# EAGLE design PlusCart (EAGLE 7.7.0)
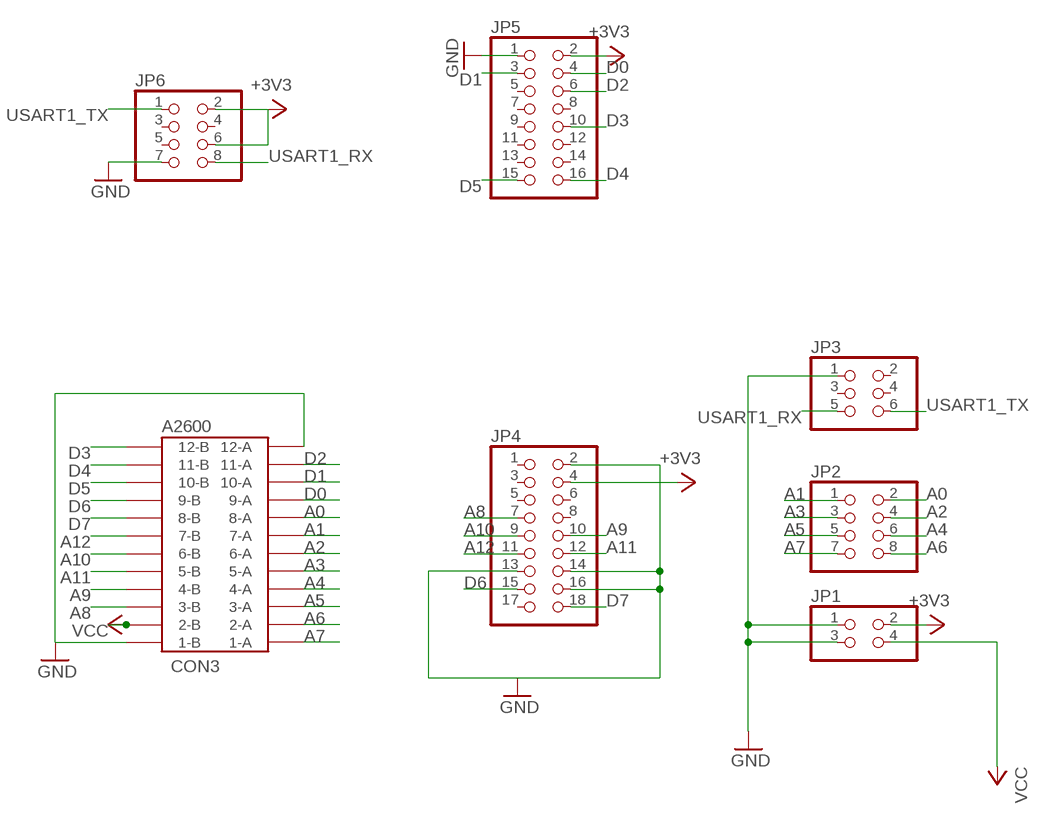
[diagram p0: schematic, sheet 1]

## Parts
CON3  A2600  24PINEDGE-254MM  [24PINEDGE-254MM]
JP1  PINHD-2X2  [2X02]
JP2  PINHD-2X4  [2X04]
JP3  PINHD-2X3  [2X03]
JP4  PINHD-2X9  [2X09]
JP5  PINHD-2X8  [2X08]
JP6  PINHD-2X4  [2X04]

## Nets
+3V3: JP1.2 JP4.4 JP5.2 JP6.2 JP6.6
A0: CON3.8-A JP2.2
A1: CON3.7-A JP2.1
A2: CON3.6-A JP2.4
A3: CON3.5-A JP2.3
A4: CON3.4-A JP2.6
A5: CON3.3-A JP2.5
A6: CON3.2-A JP2.8
A7: CON3.1-A JP2.7
A8: CON3.3-B JP4.7
A9: CON3.4-B JP4.10
A10: CON3.6-B JP4.9
A11: CON3.5-B JP4.12
A12: CON3.7-B JP4.11
D0: CON3.9-A JP5.4
D1: CON3.10-A JP5.3
D2: CON3.11-A JP5.6
D3: CON3.12-B JP5.10
D4: CON3.11-B JP5.16
D5: CON3.10-B JP5.15
D6: CON3.9-B JP4.15
D7: CON3.8-B JP4.18
GND: CON3.1-B CON3.12-A JP1.1 JP1.3 JP3.1 JP4.2 JP4.13 JP4.14 JP4.16 JP5.1 JP6.7
USART1_RX: JP3.5 JP6.8
USART1_TX: JP3.6 JP6.1
VCC: CON3.2-B JP1.4
Unconnected: JP3.2 JP3.3 JP3.4 JP4.1 JP4.3 JP4.5 JP4.6 JP4.8 JP4.17 JP5.5 JP5.7 JP5.8 JP5.9 JP5.11 JP5.12 JP5.13 JP5.14 JP6.3 JP6.4 JP6.5

## Library data of the parts
CON3 = con-edge:24PINEDGE-254MM: 24 PIN EDGE CONNECTOR 2.54mm ATARI 2600 CARTRIDGE PORT
JP1 = pinhead:PINHD-2X2: PIN HEADER
JP2 JP6 = pinhead:PINHD-2X4: PIN HEADER
JP3 = pinhead:PINHD-2X3: PIN HEADER
JP4 = pinhead:PINHD-2X9: PIN HEADER
JP5 = pinhead:PINHD-2X8: PIN HEADER

## Board
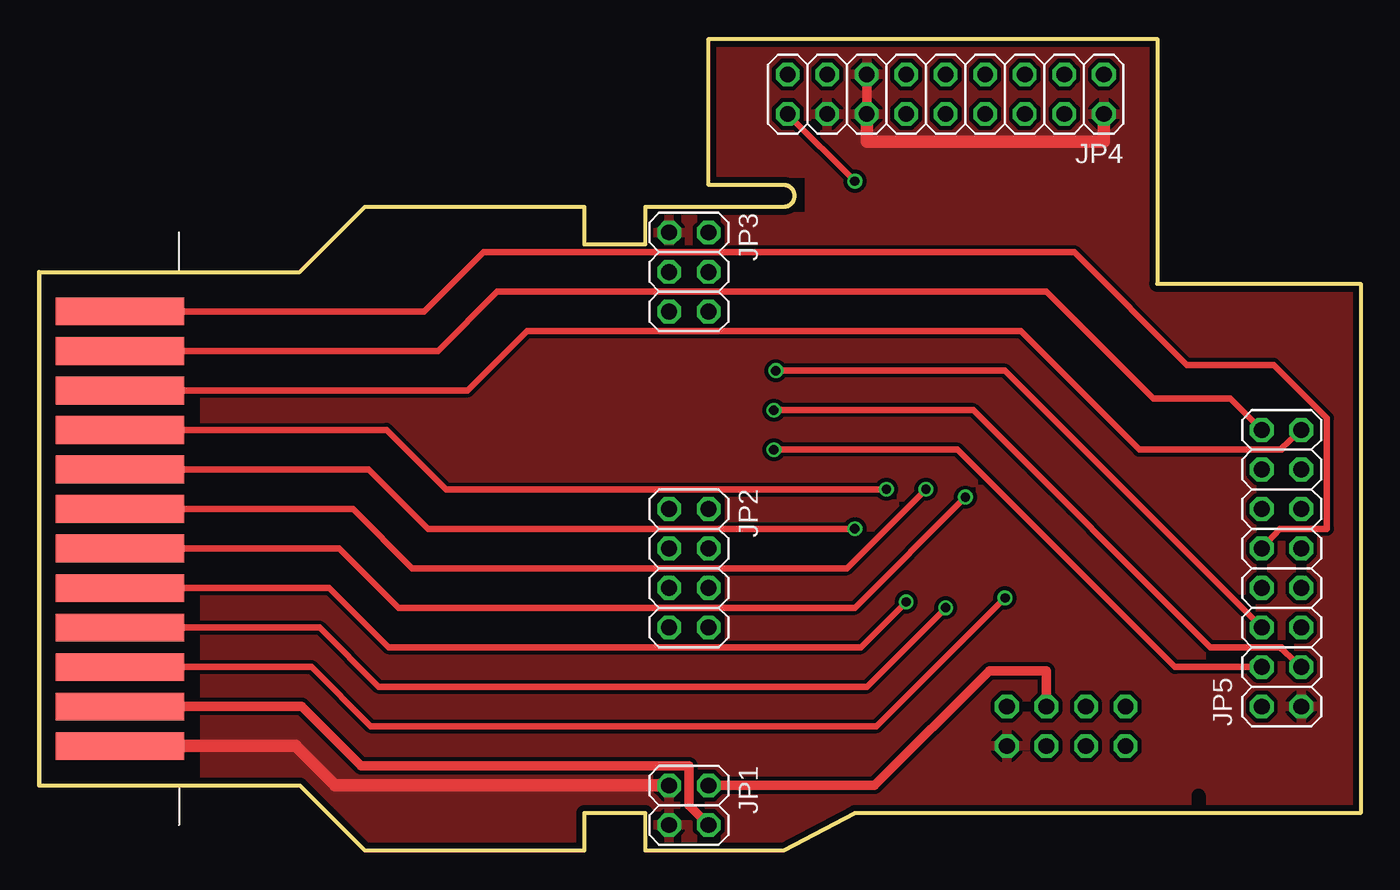
[diagram p1: board, top side]
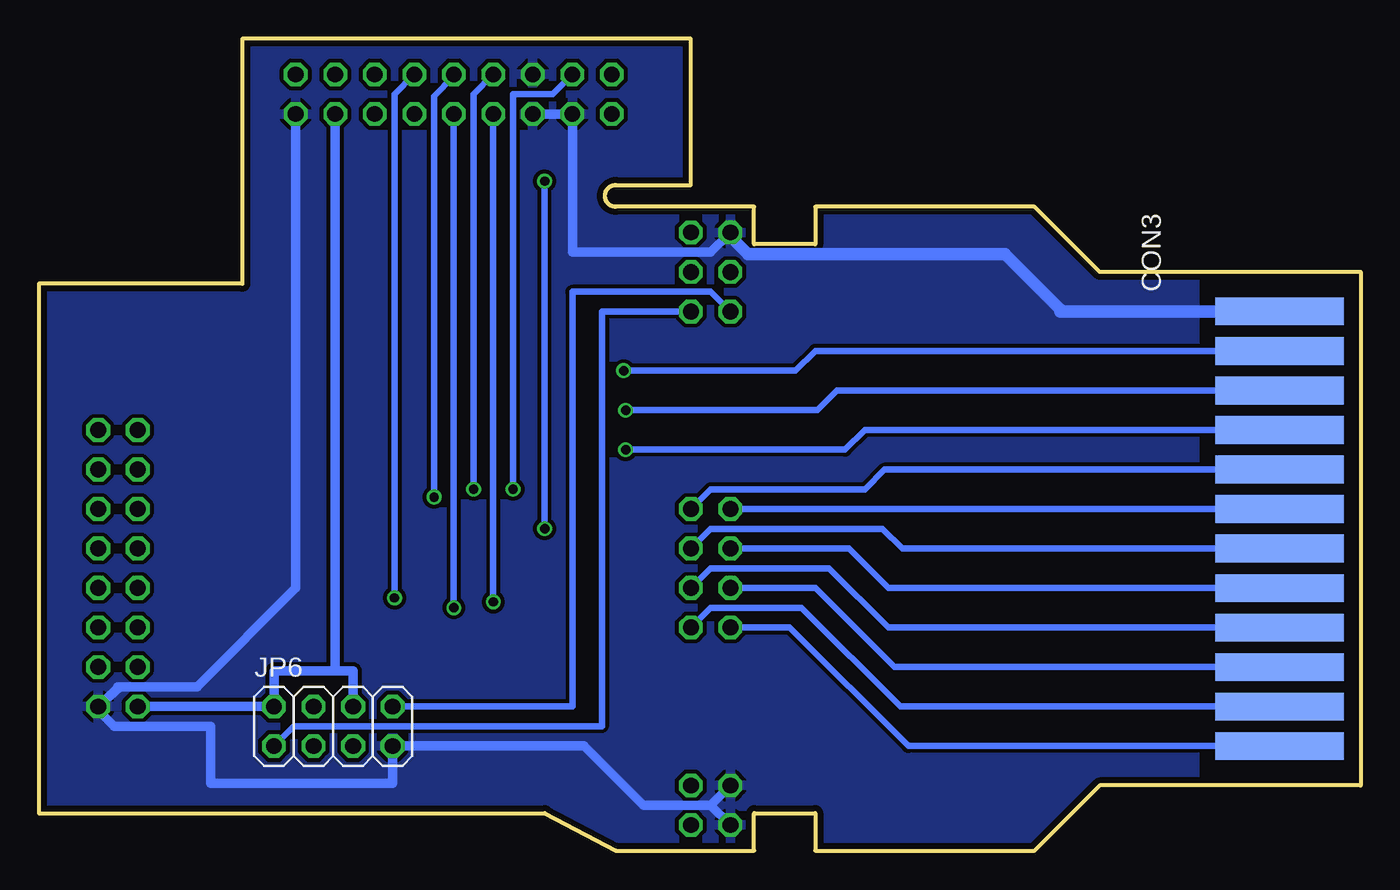
[diagram p2: board, bottom side, seen from below]

Size 84.96 x 52.2 mm. Coordinates in mm from the lower left corner, seen from the top.
Outline: 47.88,42.8 43.05,42.8 43.05,52.2 71.88,52.2 71.88,36.45 84.96,36.45 84.96,2.41 52.45,2.41 47.88,0 38.99,0 38.99,2.41 35.05,2.41 35.05,0 20.95,0 16.76,4.19 0,4.19 0,37.21 16.76,37.21 20.95,41.4 35.05,41.4 35.05,38.99 38.99,38.99 38.99,41.4 47.88,41.4 arc180 47.88,42.8
Copper layers (1*16): Top 0.0356mm / dielectric 1.5011mm / Bottom 0.0356mm
Design rules "OSHPark2layer": minimum track width 6mil, minimum drill 13mil, track to track 6mil, track to pad 6mil, pad to pad 6mil, via to via 6mil, smd to smd 6mil, copper to edge 15mil, drill to drill 6mil, minimum pad ring 7mil, minimum via ring 7mil, stop-mask expansion 3mil, vias tented up to drill 0mil, thermal gap 10mil
tRestrict: area 74.5,-2.9 to 74.5,3.6

### Footprints (pad centres in the part's own frame; a part is rotated, then mirrored left to right if it is on the bottom)
24PINEDGE-254MM = smd 1.778 x 8.255: 1-A -22.86,-7.62; 2-A -20.32,-7.62; 3-A -17.78,-7.62; 4-A -15.24,-7.62; 5-A -12.7,-7.62; 6-A -10.16,-7.62; 7-A -7.62,-7.62; 8-A -5.08,-7.62; 9-A -2.54,-7.62; 10-A 0,-7.62; 11-A 2.54,-7.62; 12-A 5.08,-7.62 | smd 1.778 x 8.255 bottom: 1-B -22.86,-7.62; 2-B -20.32,-7.62; 3-B -17.78,-7.62; 4-B -15.24,-7.62; 5-B -12.7,-7.62; 6-B -10.16,-7.62; 7-B -7.62,-7.62; 8-B -5.08,-7.62; 9-B -2.54,-7.62; 10-B 0,-7.62; 11-B 2.54,-7.62; 12-B 5.08,-7.62
2X02 = drill 1.016 octagon: 1 -1.27,-1.27; 2 -1.27,1.27; 3 1.27,-1.27; 4 1.27,1.27
2X04 = drill 1.016 octagon: 1 -3.81,-1.27; 2 -3.81,1.27; 3 -1.27,-1.27; 4 -1.27,1.27; 5 1.27,-1.27; 6 1.27,1.27; 7 3.81,-1.27; 8 3.81,1.27
2X03 = drill 1.016 octagon: 1 -2.54,-1.27; 2 -2.54,1.27; 3 0,-1.27; 4 0,1.27; 5 2.54,-1.27; 6 2.54,1.27
2X09 = drill 1.016 octagon: 1 -10.16,-1.27; 2 -10.16,1.27; 3 -7.62,-1.27; 4 -7.62,1.27; 5 -5.08,-1.27; 6 -5.08,1.27; 7 -2.54,-1.27; 8 -2.54,1.27; 9 0,-1.27; 10 0,1.27; 11 2.54,-1.27; 12 2.54,1.27; 13 5.08,-1.27; 14 5.08,1.27; 15 7.62,-1.27; 16 7.62,1.27; 17 10.16,-1.27; 18 10.16,1.27
2X08 = drill 1.016 octagon: 1 -8.89,-1.27; 2 -8.89,1.27; 3 -6.35,-1.27; 4 -6.35,1.27; 5 -3.81,-1.27; 6 -3.81,1.27; 7 -1.27,-1.27; 8 -1.27,1.27; 9 1.27,-1.27; 10 1.27,1.27; 11 3.81,-1.27; 12 3.81,1.27; 13 6.35,-1.27; 14 6.35,1.27; 15 8.89,-1.27; 16 8.89,1.27

### Placement (x,y rotation side)
CON3  12.83,29.59 90 bottom
JP1  41.78,2.92 270 top
JP2  41.78,18.16 270 top
JP3  41.78,37.21 270 top
JP4  58.29,48.64 180 top
JP5  79.88,18.16 90 top
JP6  66.04,8 0 bottom

### Tracks (layer width: path | path; a pad name or v marks a point on that pad's centre or on a via)
+3V3
  Top 0.61: JP6.6 64.77,11.56 61.09,11.56 53.72,4.19 JP1.2
  Bottom 0.61: 65.91,11.56 69.85,11.56 JP6.2 JP5.2 | 65.91,11.56 64.77,11.56 JP6.6 | JP4.4 65.91,11.56
A0
  Bottom 0.406: CON3.8-A 30.61,24.51 31.88,23.24 41.4,23.24 41.78,23.24 JP2.2
A1
  Bottom 0.406: JP2.1 CON3.7-A
A2
  Bottom 0.406: JP2.4 41.78,20.7 30.73,20.7 29.46,19.43 CON3.6-A
A3
  Bottom 0.406: CON3.5-A 30.35,16.89 32.89,19.43 JP2.3
A4
  Bottom 0.406: JP2.6 41.78,18.16 34.16,18.16 30.35,14.35 CON3.4-A
A5
  Bottom 0.406: CON3.3-A 29.97,11.81 35.05,16.89 JP2.5
A6
  Bottom 0.406: JP2.8 41.78,15.62 35.94,15.62 29.59,9.27 CON3.2-A
A7
  Bottom 0.406: CON3.1-A 29.08,6.73 36.7,14.35 JP2.7
A8  (via drill 0.6)
  Top 0.406: CON3.3-B 17.53,11.81 21.34,8 53.85,8 v62.1,16.26
  Bottom 0.406: v62.1,16.26 62.1,48.64 JP4.7
A9  (via drill 0.6)
  Top 0.406: CON3.4-B 18.03,14.35 21.84,10.54 53.21,10.54 v58.29,15.62
  Bottom 0.406: JP4.10 v58.29,15.62
A10  (via drill 0.6)
  Top 0.406: CON3.6-B 19.3,19.43 23.11,15.62 52.45,15.62 v59.56,22.73
  Bottom 0.406: v59.56,22.73 59.56,48.51 58.29,49.78 JP4.9
A11  (via drill 0.6)
  Top 0.406: CON3.5-B 18.67,16.89 22.48,13.08 52.83,13.08 v55.75,16
  Bottom 0.406: JP4.12 v55.75,16
A12  (via drill 0.6)
  Top 0.406: CON3.7-B 20.19,21.97 24,18.16 51.94,18.16 v57.02,23.24
  Bottom 0.406: v57.02,23.24 57.02,48.64 JP4.11
D0  (via drill 0.6)
  Top 0.406: v47.24,25.78 59.05,25.78 73.02,11.81 JP5.4
  Bottom 0.406: v47.24,25.78 33.15,25.78 31.88,27.05 CON3.9-A
D1  (via drill 0.6)
  Top 0.406: 79.88,13.08 79.76,13.08 | 79.76,13.08 75.31,13.08 60.07,28.32 v47.24,28.32 | JP5.3 79.76,13.08
  Bottom 0.406: v47.24,28.32 34.93,28.32 33.66,29.59 CON3.10-A
D2  (via drill 0.6)
  Top 0.406: v47.37,30.86 62.1,30.86 JP5.6
  Bottom 0.406: v47.37,30.86 36.32,30.86 35.05,32.13 CON3.11-A
D3
  Top 0.406: CON3.12-B 24.76,34.67 28.57,38.48 66.55,38.48 73.79,31.24 79.38,31.24 82.8,27.81 82.8,20.7 79.76,20.7 JP5.10
D4
  Top 0.406: CON3.11-B 25.65,32.13 29.46,35.94 64.77,35.94 71.63,29.08 76.58,29.08 JP5.16
D5
  Top 0.406: CON3.10-B 27.56,29.59 31.37,33.4 63.12,33.4 70.74,25.78 79.88,25.78 79.88,25.91 JP5.15
D6  (via drill 0.6)
  Top 0.406: CON3.9-B 22.35,27.05 26.16,23.24 v54.48,23.24
  Bottom 0.406: v54.48,23.24 54.48,48.64 51.94,48.64 JP4.15
D7  (via drill 0.6)
  Top 0.406: CON3.8-B 21.21,24.51 25.02,20.7 v52.45,20.7 | JP4.18 v52.45,43.05
  Bottom 0.406: v52.45,20.7 v52.45,43.05
GND
  Top 0.61: JP4.14 JP4.13
  Top 0.813: CON3.1-B 16.51,6.73 19.05,4.19 JP1.1 | JP4.14 53.21,45.59 68.45,45.59 JP4.2
  Bottom 0.61: 41.78,2.92 46.1,2.92 49.91,6.73 JP6.7 62.23,4.32 73.91,4.32 73.91,8 80.14,8 81.41,9.27 JP5.1 79.76,10.54 | 79.76,10.54 79.88,10.54 | 79.76,10.54 74.8,10.54 68.45,16.89 JP4.2 | JP4.14 JP4.16 50.67,38.48 41.78,38.48 JP3.1 | JP1.3 41.78,2.92 | JP1.1 41.78,2.92
  Bottom 0.813: 19.18,34.67 19.3,34.8 | 19.3,34.8 22.86,38.35 39.37,38.35 40.51,39.5 JP3.1 | 19.3,34.8 19.3,34.67 CON3.12-A
  pour Top (isolate 0.254): 10.67,36.2 10.67,4.45 16.64,4.45 17.02,4.45 21.08,0.38 34.54,0.38 34.54,2.92 39.62,2.92 39.62,2.67 39.62,0.51 48.01,0.51 48.01,0.64 52.71,-3.81 84.33,-3.81 84.33,-1.65 84.45,-1.65 84.45,53.59 43.69,53.59 43.69,43.56 49.53,43.56 49.53,40.77 49.4,40.77 39.5,40.77 39.5,38.48 34.54,38.48 34.54,40.77 21.34,40.77 21.34,40.89 16.76,36.32 10.92,36.32 10.79,36.32
  pour Bottom (isolate 0.254): 10.67,54.99 10.67,-0.25 10.67,-5.21 78.99,-5.21 86.23,-5.21 85.72,54.99
USART1_RX
  Bottom 0.406: JP3.5 41.78,35.94 50.67,35.94 50.67,9.27 JP6.8
USART1_TX
  Bottom 0.406: JP6.1 68.58,8 48.77,8 48.77,34.67 JP3.6
VCC
  Top 0.61: CON3.2-B 16.89,9.27 20.7,5.46 41.78,5.46 41.78,2.92 JP1.4

### Text on the board
tDocu: (TV side) | PlusCart V1.2 / by W.Stubig / (c) 2019
bDocu: Insert with this / side facing to you